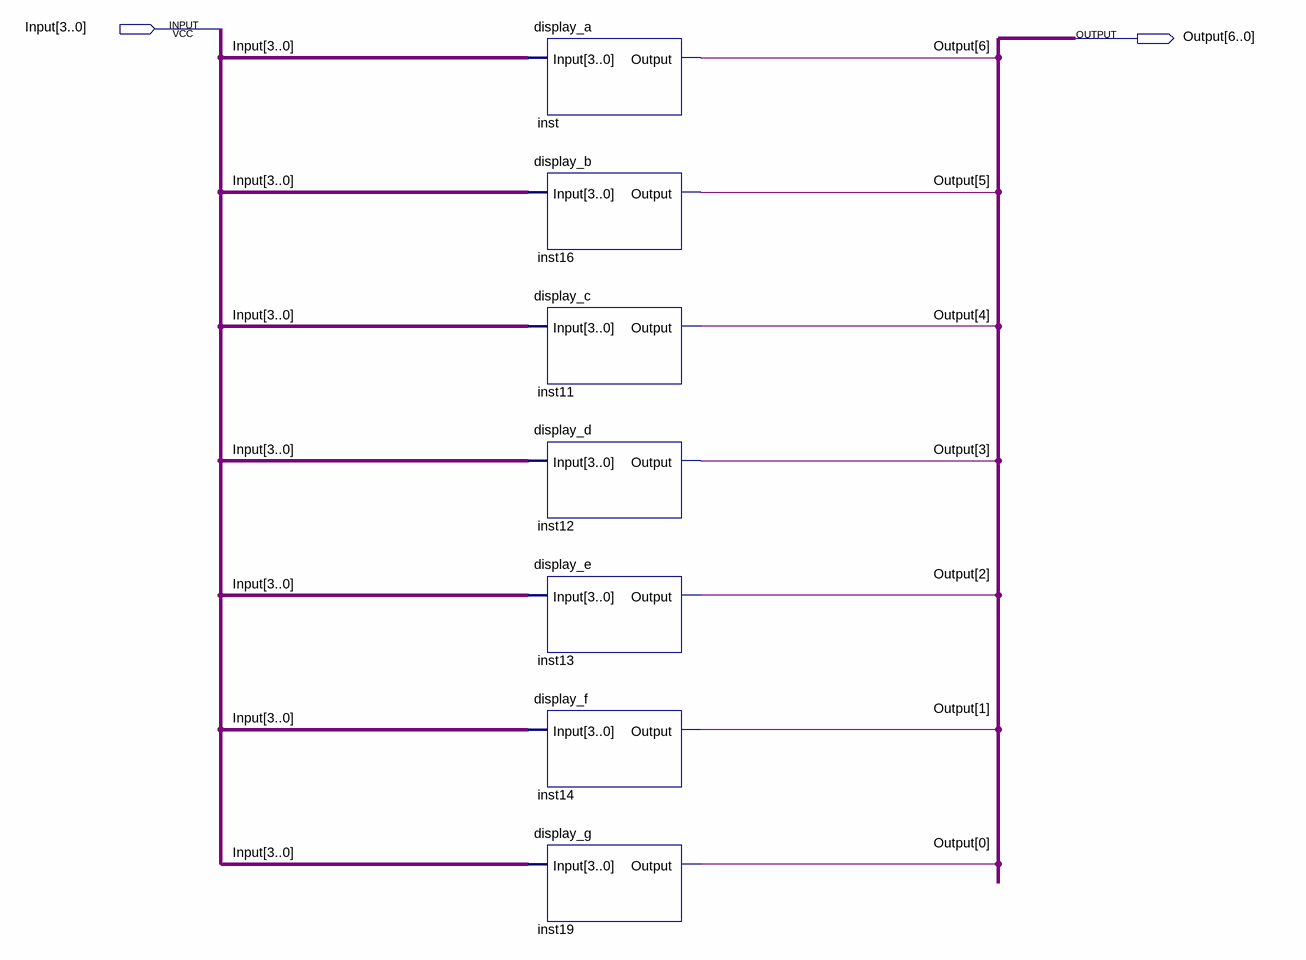
[diagram p0: schematic sheet]
// Quartus schematic decod_7_seg.bdf as structural Verilog: 7 symbols, 2 pins
module decod_7_seg (
  input  [3:0] Input,
  output [6:0] Output
);

  display_a inst (.Input(Input), .Output(Output[6]));
  display_b inst16 (.Input(Input), .Output(Output[5]));
  display_c inst11 (.Input(Input), .Output(Output[4]));
  display_d inst12 (.Input(Input), .Output(Output[3]));
  display_e inst13 (.Input(Input), .Output(Output[2]));
  display_f inst14 (.Input(Input), .Output(Output[1]));
  display_g inst19 (.Input(Input), .Output(Output[0]));
endmodule
